# EAGLE design LowSpeedRegulator (EAGLE 6.4)
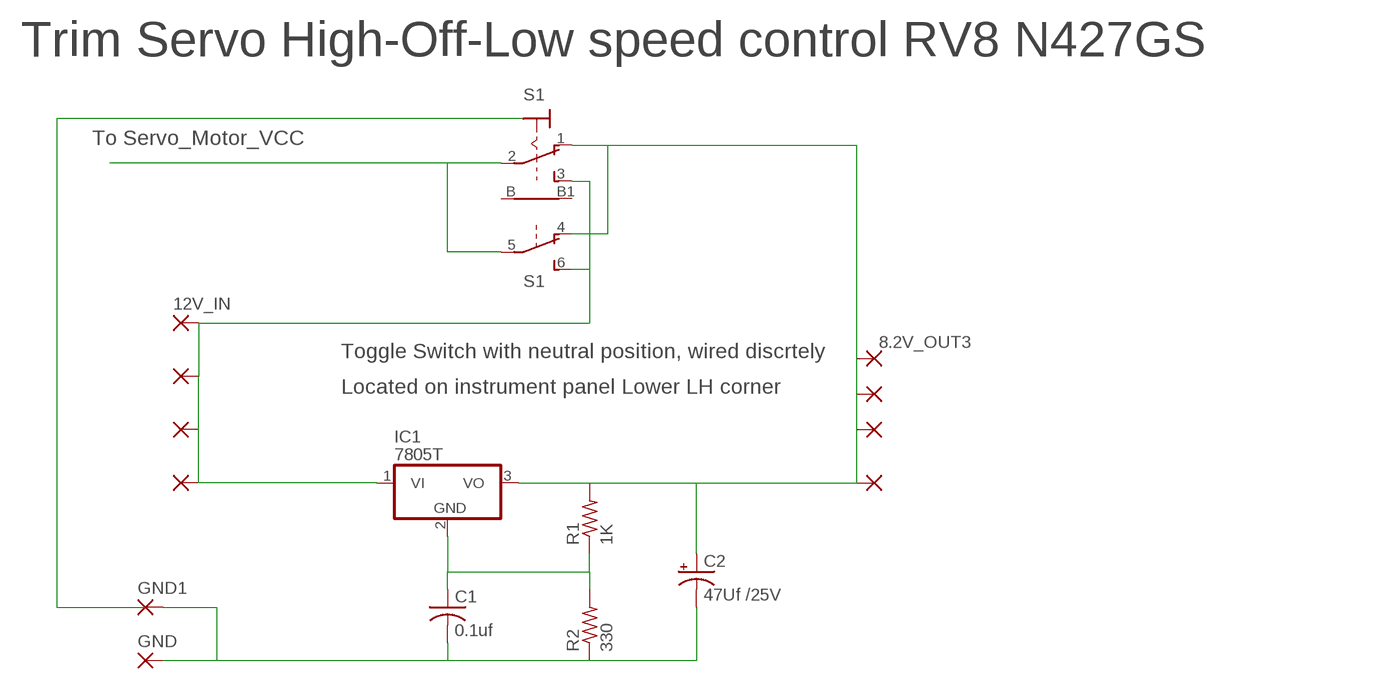
[diagram p0: schematic, sheet 1]

## Parts
6V_OUT1  3,17/1,1  [3,17/1,1]
6V_OUT2  3,17/1,1  [3,17/1,1]
6V_OUT4  3,17/1,1  [3,17/1,1]
8.2V_OUT3  3,17/1,1  [3,17/1,1]
12_V  3,17/1,1  [3,17/1,1]
12_V2  3,17/1,1  [3,17/1,1]
12V  3,17/1,1  [3,17/1,1]
12V_IN  3,17/1,1  [3,17/1,1]
C1  0.1uf  C-USC0805K  [C0805K]
C2  47Uf /25V  CPOL-USSMCD  [SMC_D]
GND  3,17/1,1  [3,17/1,1]
GND1  3,17/1,1  [3,17/1,1]
IC1  7805T  [TO220H]
R1  1K  R-US_R0805W  [R0805W]
R2  330  R-US_R0805W  [R0805W]
S1  316-923  [316-923]

## Nets
N$1: C1.1 IC1.2(GND) R1.1 R2.2
N$2: C1.2 C2.- GND1.1(P) GND.1(P) R2.1
N$3: 6V_OUT1.1(P) 6V_OUT2.1(P) 6V_OUT4.1(P) 8.2V_OUT3.1(P) C2.+ IC1.3(VO) R1.2 S1.1(2:O) S1.4(B:O)
N$4: 12_V2.1(P) 12_V.1(P) 12V.1(P) 12V_IN.1(P) IC1.1(VI) S1.3(2:S) S1.6(B:S)
N$8: S1.2(2:P) S1.5(B:P)
Unconnected: S1.B1(2:B1) S1.B(2:B)

## Notes on the sheet
- Trim Servo High-Off-Low speed control RV8 N427GS
- To Servo_Motor_VCC
- Toggle Switch with neutral position, wired discrtely
- Located on instrument panel Lower LH corner

## Library data of the parts
6V_OUT1 6V_OUT2 6V_OUT4 8.2V_OUT3 12_V 12_V2 12V 12V_IN GND GND1 = wirepad:3,17/1,1: THROUGH-HOLE PAD
C1 = rcl:C-US: CAPACITOR, American symbol
C2 = rcl:CPOL-US: POLARIZED CAPACITOR, American symbol
IC1 = linear:78*: Positive VOLTAGE REGULATOR Source: http://cache.national.com/ds/LM/LM78L05.pdf http://www.fairchildsemi.com/ds/LM/LM7805.pdf
R1 R2 = rcl:R-US_: RESISTOR, American symbol
S1 = switch:316-923: TOGGLE SWITCH Mors, distributor RS Components

## Board
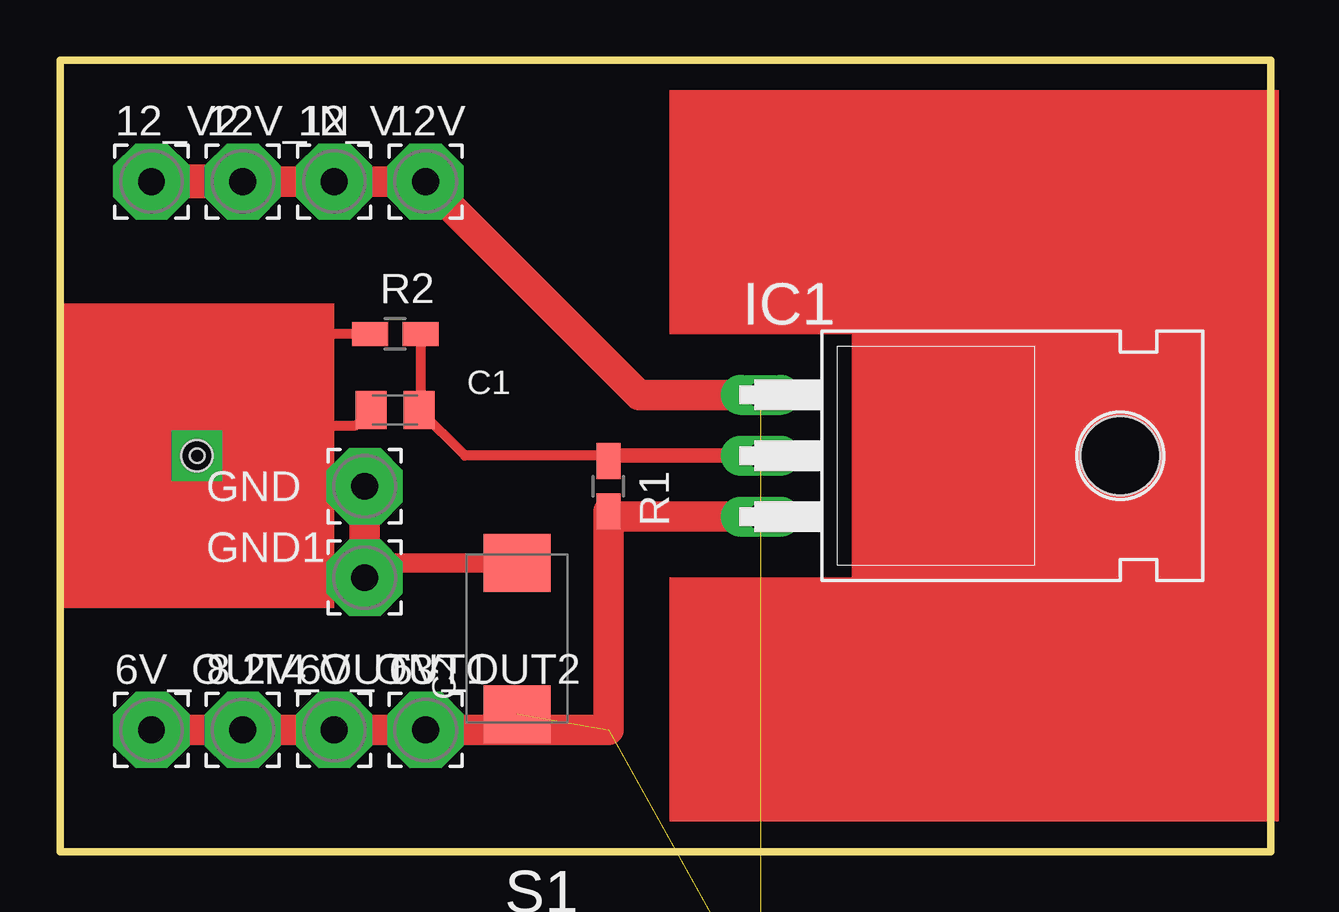
[diagram p1: board, top side]

Size 50.47 x 33.01 mm. Coordinates in mm from the lower left corner, seen from the top.
Outline: 0,0 50.47,0 50.47,33.01 0,33.01 0,0
Copper layers (1*16): Top 0.035mm / dielectric 1.5mm / Bottom 0.035mm
Design rules "default": minimum track width 10mil, minimum drill 24mil, track to track 8mil, track to pad 8mil, pad to pad 8mil, via to via 8mil, smd to smd 8mil, copper to edge 40mil, drill to drill 8mil, minimum pad ring 10mil, minimum via ring 8mil, stop-mask expansion 4mil, vias tented up to drill 0mil, thermal gap 10mil
Holes 0.6 mm at 5.72,16.51
Holes 1.3 mm at 5.72,16.51

### Footprints (pad centres in the part's own frame; a part is rotated, then mirrored left to right if it is on the bottom)
3,17/1,1 = drill 1.118 pad 3.175 octagon: 1 0,0
C0805K = smd 1.3 x 1.6: 1 -1,0; 2 1,0
SMC_D = smd 2.4 x 2.8: + -3.15,0; - 3.15,0
TO220H = drill 1.118 long: 1 -2.54,-10.16; 2 0,-10.16; 3 2.54,-10.16 | hole 3.302: 0,4.826
R0805W = smd 1.5 x 1: 1 -1.052,0; 2 1.052,0
316-923 = drill 1.016 octagon: 1 10.16,7.62; 2 15.24,5.08; 3 10.16,2.54; 4 10.16,-2.54; 5 15.24,-5.08; 6 10.16,-7.62 | drill 1.016 pad 2.54: B 0,-5.08; B1 0,5.08

### Placement (x,y rotation side)
6V_OUT1  11.43,5.08 0 top
6V_OUT2  15.24,5.08 0 top
6V_OUT4  3.81,5.08 0 top
8.2V_OUT3  7.62,5.08 0 top
12_V  11.43,27.94 0 top
12_V2  3.81,27.94 0 top
12V  15.24,27.94 0 top
12V_IN  7.62,27.94 0 top
C1  13.97,18.41 180 top
C2  19.05,8.89 90 top
GND  12.7,15.24 0 top
GND1  12.7,11.43 0 top
IC1  39.37,16.51 270 top
R1  22.86,15.24 270 top
R2  13.97,21.59 0 top
S1  19.05,-13.97 0 top  (outside the outline)

### Tracks (layer width: path | path; a pad name or v marks a point on that pad's centre or on a via)
N$1
  Top 0.406: 22.86,16.51 16.88,16.51 C1.1 15.02,18.47 R2.2
  Top 0.61: IC1.2 23.18,16.51 R1.1 22.86,16.51
N$2
  Top 0.406: R2.1 10.16,21.59 10.16,17.78 | 10.16,17.78 12.34,17.78 C1.2 | GND.1 10.16,15.24 10.16,17.78
  Top 0.813: C2.- 13.31,12.04 GND1.1
  Top 1.27: GND1.1 GND.1
N$3  (3 unrouted)
  Top 1.27: IC1.3 23.18,13.97 R1.2 22.86,5.08 6V_OUT2.1 6V_OUT1.1 8.2V_OUT3.1 6V_OUT4.1
N$4  (2 unrouted)
  Top 1.27: IC1.1 24.13,19.05 12V.1 12_V.1 12V_IN.1
  Top 1.422: 12V_IN.1 12_V2.1
N$5  (via drill 1.4)
  other vias: 5.72,16.51
N$8  (1 unrouted)
(copper drawn outside any net)
  shapes: Top area x7